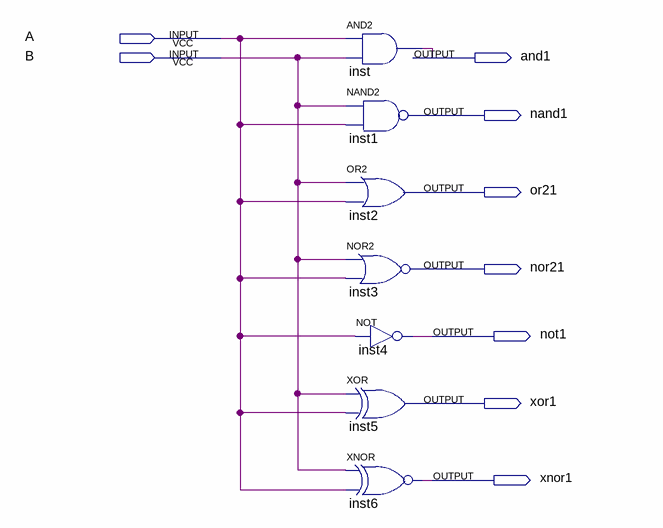
[diagram p0: schematic sheet]
// Quartus schematic logicbase.bdf as structural Verilog: 7 symbols, 9 pins
module logicbase (
  input  A,
  input  B,
  output and1,
  output nand1,
  output or21,
  output nor21,
  output not1,
  output xor1,
  output xnor1
);

  and inst (and1, A, B);
  nand inst1 (nand1, B, A);
  or inst2 (or21, B, A);
  nor inst3 (nor21, B, A);
  not inst4 (not1, A);
  xor inst5 (xor1, B, A);
  xnor inst6 (xnor1, B, A);
endmodule
